# EAGLE schematic preamp (EAGLE 7.6.0)
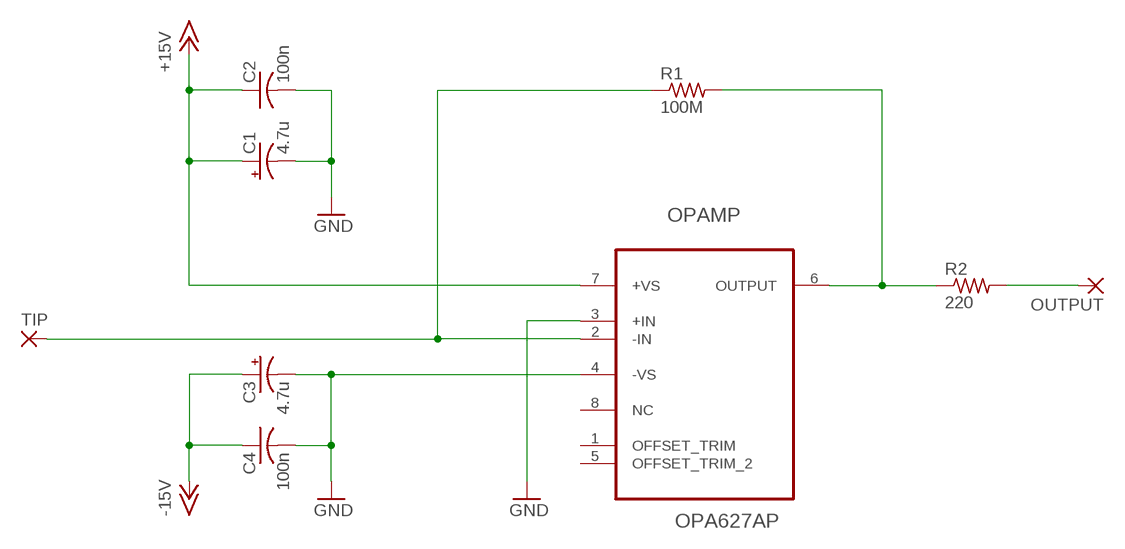
[diagram p0: schematic, sheet 1]

## Parts
C1  4.7u  CPOL-USE15-6AXIAL  [E15-6]
C2  100n  C-US050-050X075  [C050-050X075]
C3  4.7u  CPOL-USE15-6AXIAL  [E15-6]
C4  100n  C-US050-050X075  [C050-050X075]
OPAMP  OPA627AP  [DIP254P762X508-8]
OUTPUT  1,6/0,8  [1,6/0,8]
R1  100M  R-US_0204/7  [0204/7]
R2  220  R-US_0204/7  [0204/7]
TIP  1,6/0,8  [1,6/0,8]

## Nets
+15V: C1.+ C2.1 OPAMP.7(+VS)
-15V: C3.+ C4.1
GND: C1.- C2.2 C3.- C4.2 OPAMP.3(+IN) OPAMP.4(-VS)
N$1: OPAMP.6(OUTPUT) R1.2 R2.1
N$2: OPAMP.2(-IN) R1.1 TIP.1(P)
N$3: OUTPUT.1(P) R2.2
Unconnected: OPAMP.1(OFFSET_TRIM) OPAMP.5(OFFSET_TRIM_2) OPAMP.8(NC)

## Library data of the parts
C1 C3 = rcl:CPOL-US: POLARIZED CAPACITOR, American symbol
C2 C4 = rcl:C-US: CAPACITOR, American symbol
OPAMP = Texas Instruments_By_element14_Batch_1:OPA627AP: OPERATIONAL AMPLIFIER; MPN: OPA627AP; OC_FARNELL: -; OC_NEWARK: 04M6519; PACKAGE: PDIP; SUPPLIER: Texas Instruments
OUTPUT TIP = wirepad:1,6/0,8: THROUGH-HOLE PAD
R1 R2 = resistor:R-US_: RESISTOR, American symbol